# Altium project S7CAS-PLEIADES-CARTE-MERE_P01.PrjPcb (part 4 of 4)

## Sheet S7CAS-PLEIADES-CARTE-MERE_P01_FPGA-ALIM.SchDoc
size Tabloid; DocumentNumber: 17; SheetNumber: 17; SheetTotal: 17; Sheet_Name: FPGA - ALIM; Size: 11x17
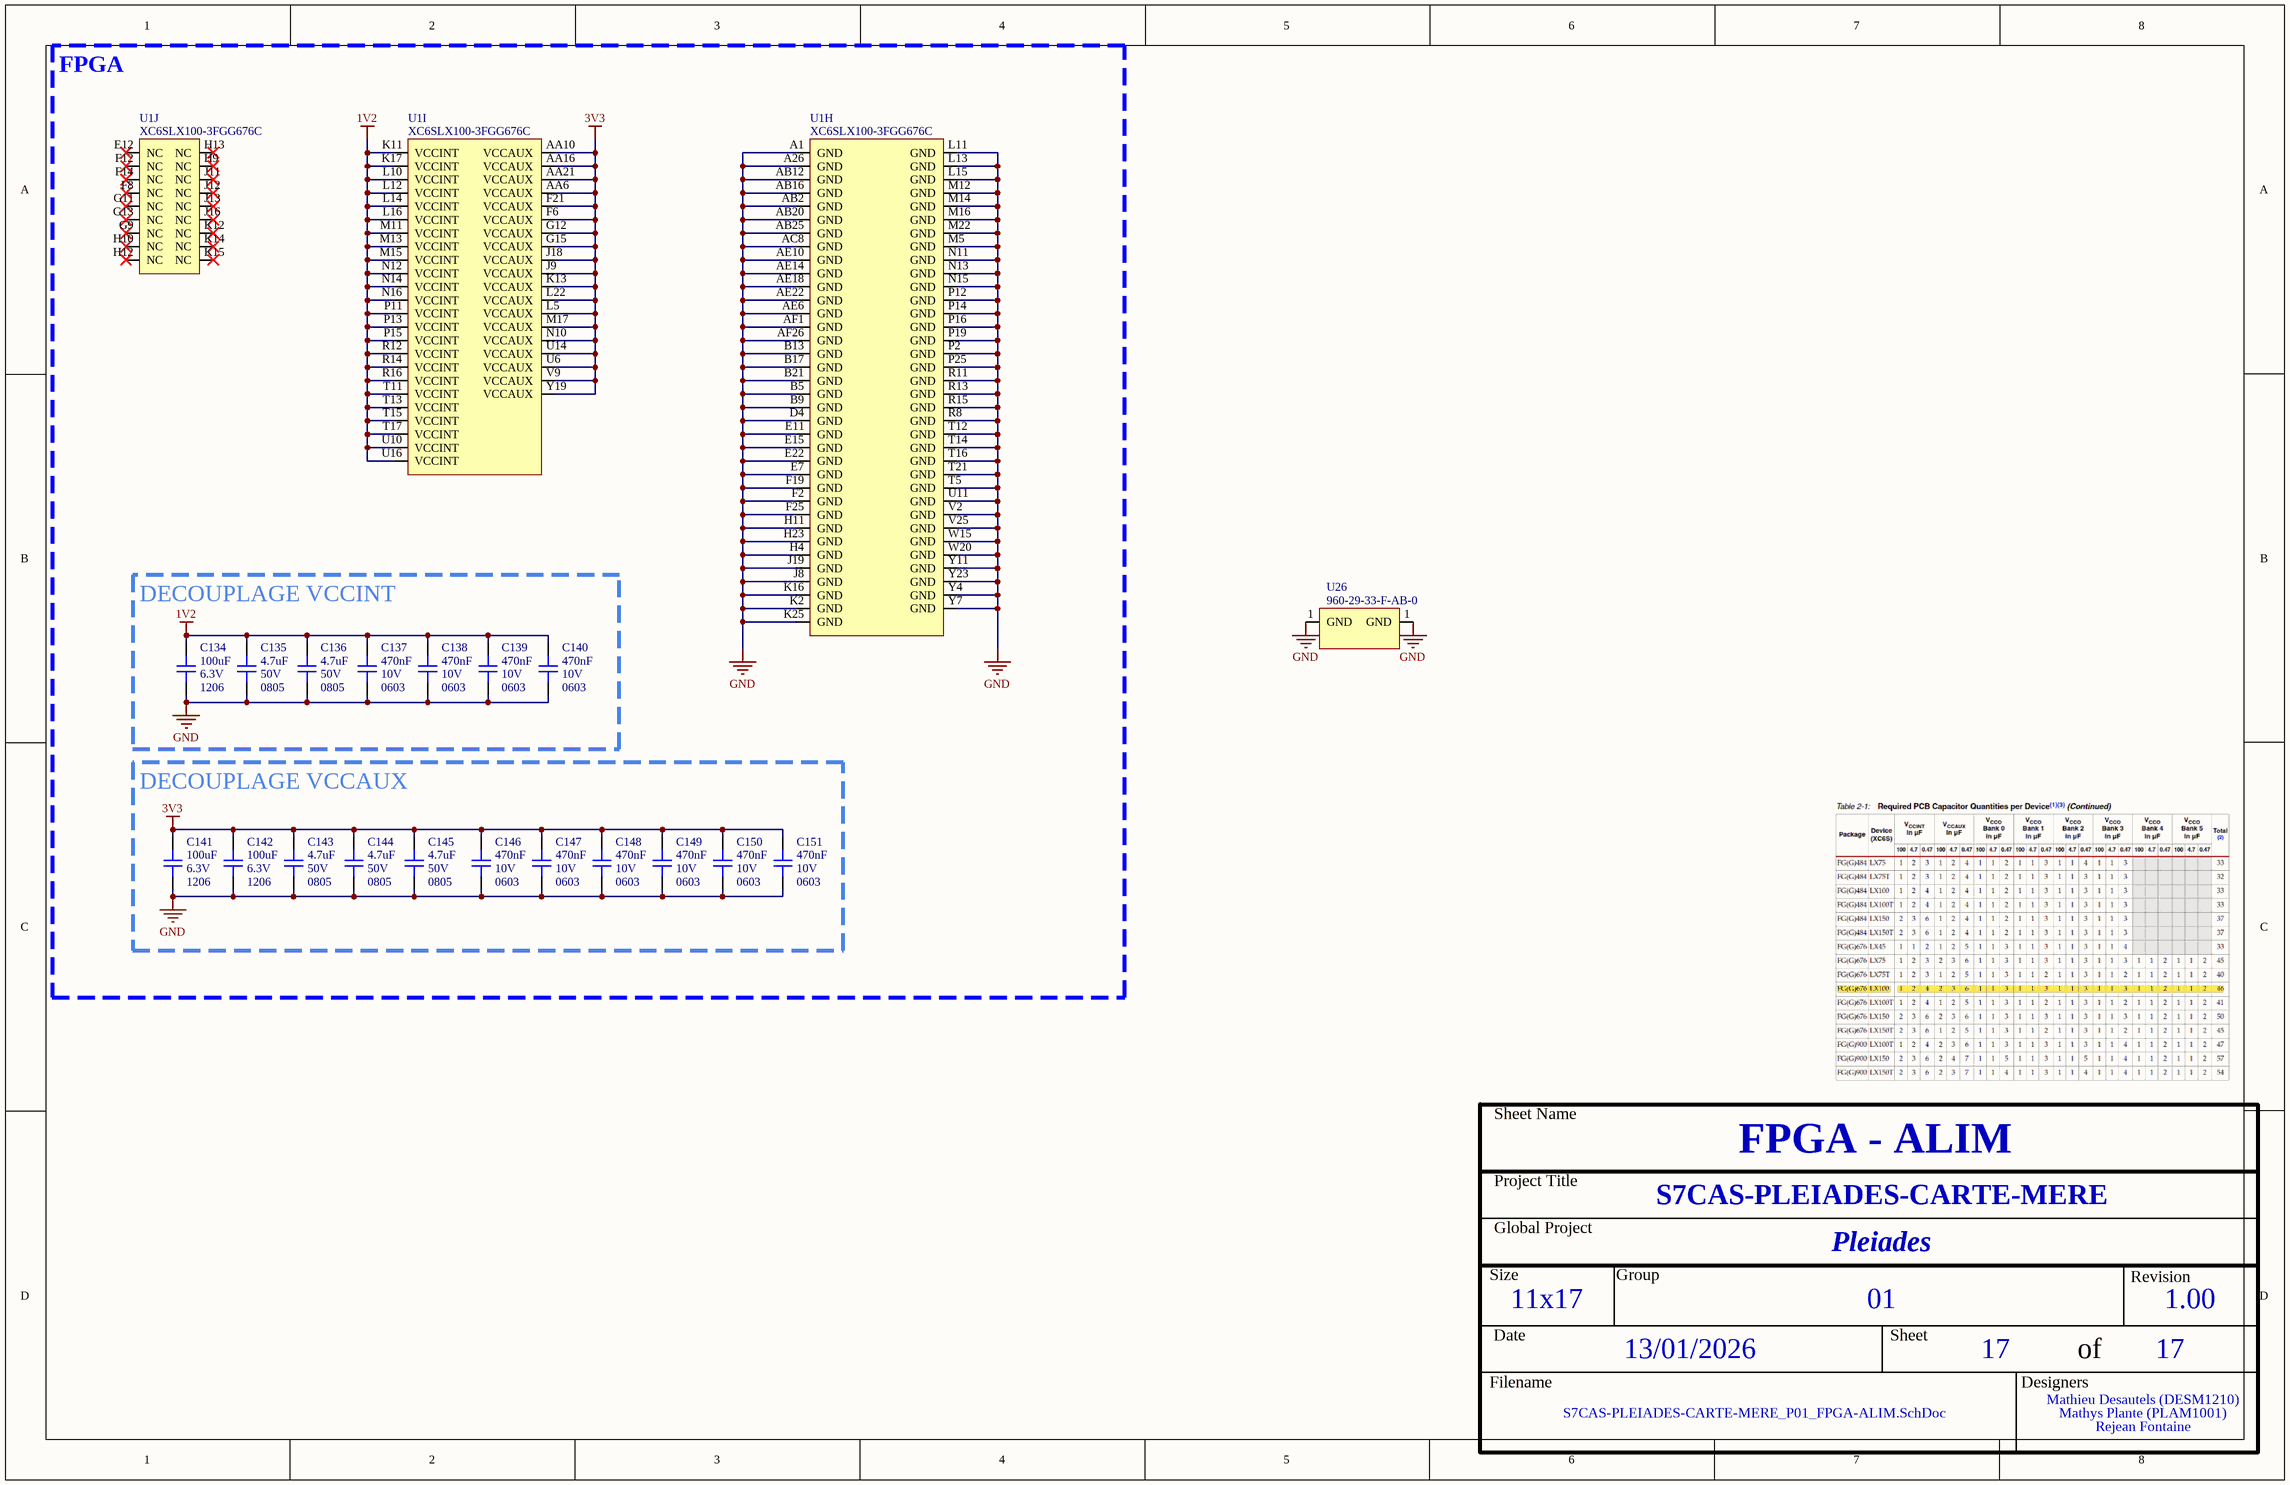
[diagram p16: S7CAS-PLEIADES-CARTE-MERE_P01_FPGA-ALIM.SchDoc]

### Parts
C134  value 100uF  Voltage: 6.3V  Package: 1206  [CAP_1206]  (hidden comment: CAP - 1206)
C135  value 4.7uF  Voltage: 50V  Package: 0805  [CAP_0805]  (hidden comment: CAP - 0805)
C136  value 4.7uF  Voltage: 50V  Package: 0805  [CAP_0805]  (hidden comment: CAP - 0805)
C137  value 470nF  Voltage: 10V  Package: 0603  [CAP_0603]  (hidden comment: CAP - 0603)
C138  value 470nF  Voltage: 10V  Package: 0603  [CAP_0603]  (hidden comment: CAP - 0603)
C139  value 470nF  Voltage: 10V  Package: 0603  [CAP_0603]  (hidden comment: CAP - 0603)
C140  value 470nF  Voltage: 10V  Package: 0603  [CAP_0603]  (hidden comment: CAP - 0603)
C141  value 100uF  Voltage: 6.3V  Package: 1206  [CAP_1206]  (hidden comment: CAP - 1206)
C142  value 100uF  Voltage: 6.3V  Package: 1206  [CAP_1206]  (hidden comment: CAP - 1206)
C143  value 4.7uF  Voltage: 50V  Package: 0805  [CAP_0805]  (hidden comment: CAP - 0805)
C144  value 4.7uF  Voltage: 50V  Package: 0805  [CAP_0805]  (hidden comment: CAP - 0805)
C145  value 4.7uF  Voltage: 50V  Package: 0805  [CAP_0805]  (hidden comment: CAP - 0805)
C146  value 470nF  Voltage: 10V  Package: 0603  [CAP_0603]  (hidden comment: CAP - 0603)
C147  value 470nF  Voltage: 10V  Package: 0603  [CAP_0603]  (hidden comment: CAP - 0603)
C148  value 470nF  Voltage: 10V  Package: 0603  [CAP_0603]  (hidden comment: CAP - 0603)
C149  value 470nF  Voltage: 10V  Package: 0603  [CAP_0603]  (hidden comment: CAP - 0603)
C150  value 470nF  Voltage: 10V  Package: 0603  [CAP_0603]  (hidden comment: CAP - 0603)
C151  value 470nF  Voltage: 10V  Package: 0603  [CAP_0603]  (hidden comment: CAP - 0603)
U1  XC6SLX100-3FGG676C  [FPGA_XILINX_FGG676]  (parts H,I,J of 10)
U26  960-29-33-F-AB-0  [3960-29-33-F-AB-0]

### Blocks framed on the sheet
FPGA: U1
DECOUPLAGE VCCINT: C134-C140
DECOUPLAGE VCCAUX: C141-C151

### Nets
1V2: C134.2 C135.2 C136.2 C137.2 C138.2 C139.2 C140.2 U1.K11(VCCINT) U1.K17(VCCINT) U1.L10(VCCINT) U1.L12(VCCINT) U1.L14(VCCINT) U1.L16(VCCINT) U1.M11(VCCINT) U1.M13(VCCINT) U1.M15(VCCINT) U1.N12(VCCINT) U1.N14(VCCINT) U1.N16(VCCINT) U1.P11(VCCINT) U1.P13(VCCINT) U1.P15(VCCINT) U1.R12(VCCINT) U1.R14(VCCINT) U1.R16(VCCINT) U1.T11(VCCINT) U1.T13(VCCINT) U1.T15(VCCINT) U1.T17(VCCINT) U1.U10(VCCINT) U1.U16(VCCINT)
3V3: C141.2 C142.2 C143.2 C144.2 C145.2 C146.2 C147.2 C148.2 C149.2 C150.2 C151.2 U1.AA6(VCCAUX) U1.AA10(VCCAUX) U1.AA16(VCCAUX) U1.AA21(VCCAUX) U1.F6(VCCAUX) U1.F21(VCCAUX) U1.G12(VCCAUX) U1.G15(VCCAUX) U1.J9(VCCAUX) U1.J18(VCCAUX) U1.K13(VCCAUX) U1.L5(VCCAUX) U1.L22(VCCAUX) U1.M17(VCCAUX) U1.N10(VCCAUX) U1.U6(VCCAUX) U1.U14(VCCAUX) U1.V9(VCCAUX) U1.Y19(VCCAUX)  [project net VDD_3V3]
GND: C134.1 C135.1 C136.1 C137.1 C138.1 C139.1 C140.1 C141.1 C142.1 C143.1 C144.1 C145.1 C146.1 C147.1 C148.1 C149.1 C150.1 C151.1 U1.A1(GND) U1.A26(GND) U1.AB2(GND) U1.AB12(GND) U1.AB16(GND) U1.AB20(GND) U1.AB25(GND) U1.AC8(GND) U1.AE6(GND) U1.AE10(GND) U1.AE14(GND) U1.AE18(GND) U1.AE22(GND) U1.AF1(GND) U1.AF26(GND) U1.B5(GND) U1.B9(GND) U1.B13(GND) U1.B17(GND) U1.B21(GND) U1.D4(GND) U1.E7(GND) U1.E11(GND) U1.E15(GND) U1.E22(GND) U1.F2(GND) U1.F19(GND) U1.F25(GND) U1.H4(GND) U1.H11(GND) U1.H23(GND) U1.J8(GND) U1.J19(GND) U1.K2(GND) U1.K16(GND) U1.K25(GND) U1.L11(GND) U1.L13(GND) U1.L15(GND) U1.M5(GND) U1.M12(GND) U1.M14(GND) U1.M16(GND) U1.M22(GND) U1.N11(GND) U1.N13(GND) U1.N15(GND) U1.P2(GND) U1.P12(GND) U1.P14(GND) U1.P16(GND) U1.P19(GND) U1.P25(GND) U1.R8(GND) U1.R11(GND) U1.R13(GND) U1.R15(GND) U1.T5(GND) U1.T12(GND) U1.T14(GND) U1.T16(GND) U1.T21(GND) U1.U11(GND) U1.V2(GND) U1.V25(GND) U1.W15(GND) U1.W20(GND) U1.Y4(GND) U1.Y7(GND) U1.Y11(GND) U1.Y23(GND) U26.1(GND)

Not connected (* = marked no-connect by the designer): U1 E12(NC)* F8(NC)* F12(NC)* F14(NC)* G9(NC)* G11(NC)* G13(NC)* H9(NC)* H10(NC)* H12(NC)* H13(NC)* J11(NC)* J12(NC)* J13(NC)* J16(NC)* K12(NC)* K14(NC)* K15(NC)*

### Notes on the sheet
- Sheet Name
- Project Title
- Global Project
- Size
- Group
- Revision
- Date
- Sheet
- of
- Filename
- Designers

### Library data of the parts
C134 C141 C142 = CAP - 1206: 100 µF ±20% 6.3V Ceramic Capacitor X6T 1206 (3216 Metric); Mfg Part Number: GRM31CD80J107MEA8K; Mfg: Murata Electronics; Current: *; CreatedBy: Jonathan Bouchard; Power: *; Precision: 20%
C135 C136 C143-C145 = CAP - 0805: 4.7 µF ±10% 50V Ceramic Capacitor X5R 0805 (2012 Metric); Mfg Part Number: GRT21BR61H475KE13L; Mfg: Murata Electronics; Current: *; CreatedBy: Jonathan Bouchard; Power: *; Precision: 10%
C137-C140 C146-C151 = CAP - 0603: Mfg Part Number: C0603X474K8RAC; Precision: 10%; Current: *; CreatedBy: Jonathan Bouchard; Power: *
U1 = FPGA_XC6SLX100-3FGG676C: FPGA - XILINX SPARTAN 6 480 I/O - BGA-676; Voltage: 1.14 V ~ 1.26 V; Current: *; Power: *; Mfg: Xilinx; Mfg Part Number: XC6SLX100-3FGG676C; HelpURL: https://www.xilinx.com/support/documentation/data_sheets/ds162.pdf; CreatedBy: Jonathan Bouchard; Temperature: 0°C ~ 85°C (TJ); Value: *; Precision: *; Package: BGA-676; Supplier 1: Digikey; Supplier Part Number 1: 122-1760-ND; Part Number #1: XC6SLX100-3FGG676C
U26 = 960-29-33-F-AB-0: XXX - Description - Package; GRAMS Lib Spec: 2.7

## Nets that join several sheets
1V2: S7CAS-PLEIADES-CARTE-MERE_P01_ALIM (5 pins), S7CAS-PLEIADES-CARTE-MERE_P01_FPGA-ALIM (31 pins)
5V_AMP: S7CAS-PLEIADES-CARTE-MERE_P01_ALIM (C68.2 R133.2 U25.1 U25.20), S7CAS-PLEIADES-CARTE-MERE_P01_CNA (5 pins), S7CAS-PLEIADES-CARTE-MERE_P01_CAN (12 pins)
+24V: S7CAS-PLEIADES-CARTE-MERE_P01_ALIM (13 pins), S7CAS-PLEIADES-CARTE-MERE_P01_MOTORS (5 pins)
-5V_AMP: S7CAS-PLEIADES-CARTE-MERE_P01_ALIM (C112.2 R125.2 U20.1 U20.20), S7CAS-PLEIADES-CARTE-MERE_P01_CNA (5 pins), S7CAS-PLEIADES-CARTE-MERE_P01_CAN (10 pins)
ANA_3V3: S7CAS-PLEIADES-CARTE-MERE_P01_ALIM (C102.2 R117.2 U19.9 U19.10), S7CAS-PLEIADES-CARTE-MERE_P01_CNA (8 pins), S7CAS-PLEIADES-CARTE-MERE_P01_CAN (7 pins)
CLK_1V8: S7CAS-PLEIADES-CARTE-MERE_P01_ALIM (5 pins), S7CAS-PLEIADES-CARTE-MERE_P01_CNA (12 pins), S7CAS-PLEIADES-CARTE-MERE_P01_CAN (8 pins), S7CAS-PLEIADES-CARTE-MERE_P01_FPGA-BANK4 (10 pins)
GND: S7CAS-PLEIADES-CARTE-MERE_P01_ALIM (92 pins), S7CAS-PLEIADES-CARTE-MERE_P01_CLOCK (20 pins), S7CAS-PLEIADES-CARTE-MERE_P01_ETHERNET (25 pins), S7CAS-PLEIADES-CARTE-MERE_P01_CNA (41 pins), S7CAS-PLEIADES-CARTE-MERE_P01_CAN (46 pins), S7CAS-PLEIADES-CARTE-MERE_P01_DDR3 (79 pins), S7CAS-PLEIADES-CARTE-MERE_P01_MOTORS (20 pins), S7CAS-PLEIADES-CARTE-MERE_P01_IO (15 pins), S7CAS-PLEIADES-CARTE-MERE_P01_FPGA-BANK0 (C25.1 C33.1 C34.1 C35.1), S7CAS-PLEIADES-CARTE-MERE_P01_FPGA-BANK1 (C62.1 C63.1 C64.1 C65.1), S7CAS-PLEIADES-CARTE-MERE_P01_FPGA-BANK2 (23 pins), S7CAS-PLEIADES-CARTE-MERE_P01_FPGA-BANK3 (7 pins), S7CAS-PLEIADES-CARTE-MERE_P01_FPGA-BANK4 (C130.1 C131.1 C132.1 C133.1), S7CAS-PLEIADES-CARTE-MERE_P01_FPGA-ALIM (90 pins)
VCC1V5: S7CAS-PLEIADES-CARTE-MERE_P01_ALIM (5 pins), S7CAS-PLEIADES-CARTE-MERE_P01_DDR3 (40 pins), S7CAS-PLEIADES-CARTE-MERE_P01_FPGA-BANK3 (14 pins)
VDD_3V3: S7CAS-PLEIADES-CARTE-MERE_P01_ALIM (10 pins), S7CAS-PLEIADES-CARTE-MERE_P01_CLOCK (24 pins), S7CAS-PLEIADES-CARTE-MERE_P01_ETHERNET (10 pins), S7CAS-PLEIADES-CARTE-MERE_P01_DDR3 (C117.2 U3.10), S7CAS-PLEIADES-CARTE-MERE_P01_MOTORS (C1.2 R92.2 R95.2 U10.10), S7CAS-PLEIADES-CARTE-MERE_P01_IO (12 pins), S7CAS-PLEIADES-CARTE-MERE_P01_FPGA-BANK0 (16 pins), S7CAS-PLEIADES-CARTE-MERE_P01_FPGA-BANK1 (13 pins), S7CAS-PLEIADES-CARTE-MERE_P01_FPGA-BANK2 (35 pins), S7CAS-PLEIADES-CARTE-MERE_P01_FPGA-BANK5 (6 pins), S7CAS-PLEIADES-CARTE-MERE_P01_FPGA-ALIM (30 pins)
VREF0V75: S7CAS-PLEIADES-CARTE-MERE_P01_DDR3 (C50.2 U2.H1 U2.M8 U3.6), S7CAS-PLEIADES-CARTE-MERE_P01_FPGA-BANK3 (7 pins)
CAN_CLK_N: S7CAS-PLEIADES-CARTE-MERE_P01_CLOCK (U12.20), S7CAS-PLEIADES-CARTE-MERE_P01_CAN (C100.2 R60.1)
CAN_CLK_P: S7CAS-PLEIADES-CARTE-MERE_P01_CLOCK (U12.19), S7CAS-PLEIADES-CARTE-MERE_P01_CAN (C99.2 R59.2)
CAN_CLKOUT_N: S7CAS-PLEIADES-CARTE-MERE_P01_CAN (U8.57), S7CAS-PLEIADES-CARTE-MERE_P01_FPGA-BANK0 (U1.A14)
CAN_CLKOUT_P: S7CAS-PLEIADES-CARTE-MERE_P01_CAN (U8.56), S7CAS-PLEIADES-CARTE-MERE_P01_FPGA-BANK0 (U1.B14)
CAN_CTRL1: S7CAS-PLEIADES-CARTE-MERE_P01_CAN (U8.35), S7CAS-PLEIADES-CARTE-MERE_P01_FPGA-BANK4 (U1.M3)
CAN_CTRL2: S7CAS-PLEIADES-CARTE-MERE_P01_CAN (U8.36), S7CAS-PLEIADES-CARTE-MERE_P01_FPGA-BANK4 (U1.M1)
CAN_CTRL3: S7CAS-PLEIADES-CARTE-MERE_P01_CAN (U8.37), S7CAS-PLEIADES-CARTE-MERE_P01_FPGA-BANK4 (U1.L2)
CAN_DA0_N: S7CAS-PLEIADES-CARTE-MERE_P01_CAN (U8.40), S7CAS-PLEIADES-CARTE-MERE_P01_FPGA-BANK0 (U1.G14)
CAN_DA0_P: S7CAS-PLEIADES-CARTE-MERE_P01_CAN (U8.41), S7CAS-PLEIADES-CARTE-MERE_P01_FPGA-BANK0 (U1.J14)
CAN_DA2_N: S7CAS-PLEIADES-CARTE-MERE_P01_CAN (U8.42), S7CAS-PLEIADES-CARTE-MERE_P01_FPGA-BANK0 (U1.D15)
CAN_DA2_P: S7CAS-PLEIADES-CARTE-MERE_P01_CAN (U8.43), S7CAS-PLEIADES-CARTE-MERE_P01_FPGA-BANK0 (U1.E14)
CAN_DA4_N: S7CAS-PLEIADES-CARTE-MERE_P01_CAN (U8.44), S7CAS-PLEIADES-CARTE-MERE_P01_FPGA-BANK0 (U1.C16)
CAN_DA4_P: S7CAS-PLEIADES-CARTE-MERE_P01_CAN (U8.45), S7CAS-PLEIADES-CARTE-MERE_P01_FPGA-BANK0 (U1.D16)
CAN_DA6_N: S7CAS-PLEIADES-CARTE-MERE_P01_CAN (U8.46), S7CAS-PLEIADES-CARTE-MERE_P01_FPGA-BANK0 (U1.F15)
CAN_DA6_P: S7CAS-PLEIADES-CARTE-MERE_P01_CAN (U8.47), S7CAS-PLEIADES-CARTE-MERE_P01_FPGA-BANK0 (U1.G16)
CAN_DA8_N: S7CAS-PLEIADES-CARTE-MERE_P01_CAN (U8.50), S7CAS-PLEIADES-CARTE-MERE_P01_FPGA-BANK0 (U1.E17)
CAN_DA8_P: S7CAS-PLEIADES-CARTE-MERE_P01_CAN (U8.51), S7CAS-PLEIADES-CARTE-MERE_P01_FPGA-BANK0 (U1.F17)
CAN_DA10_N: S7CAS-PLEIADES-CARTE-MERE_P01_CAN (U8.52), S7CAS-PLEIADES-CARTE-MERE_P01_FPGA-BANK0 (U1.E16)
CAN_DA10_P: S7CAS-PLEIADES-CARTE-MERE_P01_CAN (U8.53), S7CAS-PLEIADES-CARTE-MERE_P01_FPGA-BANK0 (U1.F16)
CAN_DA12_N: S7CAS-PLEIADES-CARTE-MERE_P01_CAN (U8.54), S7CAS-PLEIADES-CARTE-MERE_P01_FPGA-BANK0 (U1.A17)
CAN_DA12_P: S7CAS-PLEIADES-CARTE-MERE_P01_CAN (U8.55), S7CAS-PLEIADES-CARTE-MERE_P01_FPGA-BANK0 (U1.C17)
CAN_DB0_N: S7CAS-PLEIADES-CARTE-MERE_P01_CAN (U8.60), S7CAS-PLEIADES-CARTE-MERE_P01_FPGA-BANK0 (U1.H15)
CAN_DB0_P: S7CAS-PLEIADES-CARTE-MERE_P01_CAN (U8.61), S7CAS-PLEIADES-CARTE-MERE_P01_FPGA-BANK0 (U1.J15)
CAN_DB2_N: S7CAS-PLEIADES-CARTE-MERE_P01_CAN (U8.62), S7CAS-PLEIADES-CARTE-MERE_P01_FPGA-BANK0 (U1.C18)
CAN_DB2_P: S7CAS-PLEIADES-CARTE-MERE_P01_CAN (U8.63), S7CAS-PLEIADES-CARTE-MERE_P01_FPGA-BANK0 (U1.D18)
CAN_DB4_N: S7CAS-PLEIADES-CARTE-MERE_P01_CAN (U8.2), S7CAS-PLEIADES-CARTE-MERE_P01_FPGA-BANK0 (U1.D19)
CAN_DB4_P: S7CAS-PLEIADES-CARTE-MERE_P01_CAN (U8.3), S7CAS-PLEIADES-CARTE-MERE_P01_FPGA-BANK0 (U1.E19)
CAN_DB6_N: S7CAS-PLEIADES-CARTE-MERE_P01_CAN (U8.4), S7CAS-PLEIADES-CARTE-MERE_P01_FPGA-BANK0 (U1.G17)
CAN_DB6_P: S7CAS-PLEIADES-CARTE-MERE_P01_CAN (U8.5), S7CAS-PLEIADES-CARTE-MERE_P01_FPGA-BANK0 (U1.H16)
CAN_DB8_N: S7CAS-PLEIADES-CARTE-MERE_P01_CAN (U8.6), S7CAS-PLEIADES-CARTE-MERE_P01_FPGA-BANK0 (U1.C20)
CAN_DB8_P: S7CAS-PLEIADES-CARTE-MERE_P01_CAN (U8.7), S7CAS-PLEIADES-CARTE-MERE_P01_FPGA-BANK0 (U1.D21)
CAN_DB10_N: S7CAS-PLEIADES-CARTE-MERE_P01_CAN (U8.8), S7CAS-PLEIADES-CARTE-MERE_P01_FPGA-BANK0 (U1.E18)
CAN_DB10_P: S7CAS-PLEIADES-CARTE-MERE_P01_CAN (U8.9), S7CAS-PLEIADES-CARTE-MERE_P01_FPGA-BANK0 (U1.F18)
CAN_DB12_N: S7CAS-PLEIADES-CARTE-MERE_P01_CAN (U8.10), S7CAS-PLEIADES-CARTE-MERE_P01_FPGA-BANK0 (U1.D20)
CAN_DB12_P: S7CAS-PLEIADES-CARTE-MERE_P01_CAN (U8.11), S7CAS-PLEIADES-CARTE-MERE_P01_FPGA-BANK0 (U1.E20)
CAN_RESET: S7CAS-PLEIADES-CARTE-MERE_P01_CAN (U8.12), S7CAS-PLEIADES-CARTE-MERE_P01_FPGA-BANK4 (U1.K8)
CAN_SCLK: S7CAS-PLEIADES-CARTE-MERE_P01_CAN (U8.13), S7CAS-PLEIADES-CARTE-MERE_P01_FPGA-BANK4 (U1.L8)
CAN_SDATA: S7CAS-PLEIADES-CARTE-MERE_P01_CAN (U8.14), S7CAS-PLEIADES-CARTE-MERE_P01_FPGA-BANK4 (U1.N1)
CAN_SDOUT: S7CAS-PLEIADES-CARTE-MERE_P01_CAN (U8.64), S7CAS-PLEIADES-CARTE-MERE_P01_FPGA-BANK4 (U1.L1)
CAN_SEN: S7CAS-PLEIADES-CARTE-MERE_P01_CAN (U8.15), S7CAS-PLEIADES-CARTE-MERE_P01_FPGA-BANK4 (U1.N2)
CLK_OSI_125M_OE: S7CAS-PLEIADES-CARTE-MERE_P01_CLOCK (Y2.2), S7CAS-PLEIADES-CARTE-MERE_P01_FPGA-BANK2 (U1.U15)
CLK_PLL_LOCK: S7CAS-PLEIADES-CARTE-MERE_P01_CLOCK (U12.37), S7CAS-PLEIADES-CARTE-MERE_P01_FPGA-BANK2 (U1.AD11)
CLK_PWRDN: S7CAS-PLEIADES-CARTE-MERE_P01_CLOCK (U12.12), S7CAS-PLEIADES-CARTE-MERE_P01_FPGA-BANK2 (U1.V14)
CLK_SPI_CLK: S7CAS-PLEIADES-CARTE-MERE_P01_CLOCK (U12.24), S7CAS-PLEIADES-CARTE-MERE_P01_FPGA-BANK2 (U1.AB11)
CLK_SPI_LE: S7CAS-PLEIADES-CARTE-MERE_P01_CLOCK (U12.25), S7CAS-PLEIADES-CARTE-MERE_P01_FPGA-BANK2 (U1.AA11)
CLK_SPI_MISO: S7CAS-PLEIADES-CARTE-MERE_P01_CLOCK (R54.2), S7CAS-PLEIADES-CARTE-MERE_P01_FPGA-BANK2 (U1.W14)
CLK_SPI_MOSI: S7CAS-PLEIADES-CARTE-MERE_P01_CLOCK (U12.23), S7CAS-PLEIADES-CARTE-MERE_P01_FPGA-BANK2 (U1.V13)
CLK_SYNC: S7CAS-PLEIADES-CARTE-MERE_P01_CLOCK (U12.14), S7CAS-PLEIADES-CARTE-MERE_P01_FPGA-BANK2 (U1.AC11)
CNA_CLK_N: S7CAS-PLEIADES-CARTE-MERE_P01_CLOCK (U12.17), S7CAS-PLEIADES-CARTE-MERE_P01_CNA (C95.2 R91.1)
CNA_CLK_P: S7CAS-PLEIADES-CARTE-MERE_P01_CLOCK (U12.16), S7CAS-PLEIADES-CARTE-MERE_P01_CNA (C94.2 R72.2)
CNA_CS: S7CAS-PLEIADES-CARTE-MERE_P01_CNA (U7.33), S7CAS-PLEIADES-CARTE-MERE_P01_FPGA-BANK4 (U1.H1)
CNA_D0_N: S7CAS-PLEIADES-CARTE-MERE_P01_CNA (U7.28), S7CAS-PLEIADES-CARTE-MERE_P01_FPGA-BANK0 (U1.D7)
CNA_D0_P: S7CAS-PLEIADES-CARTE-MERE_P01_CNA (U7.27), S7CAS-PLEIADES-CARTE-MERE_P01_FPGA-BANK0 (U1.E8)
CNA_D1_N: S7CAS-PLEIADES-CARTE-MERE_P01_CNA (U7.26), S7CAS-PLEIADES-CARTE-MERE_P01_FPGA-BANK0 (U1.C8)
CNA_D1_P: S7CAS-PLEIADES-CARTE-MERE_P01_CNA (U7.25), S7CAS-PLEIADES-CARTE-MERE_P01_FPGA-BANK0 (U1.D8)
CNA_D2_N: S7CAS-PLEIADES-CARTE-MERE_P01_CNA (U7.24), S7CAS-PLEIADES-CARTE-MERE_P01_FPGA-BANK0 (U1.E9)
CNA_D2_P: S7CAS-PLEIADES-CARTE-MERE_P01_CNA (U7.23), S7CAS-PLEIADES-CARTE-MERE_P01_FPGA-BANK0 (U1.F9)
CNA_D3_N: S7CAS-PLEIADES-CARTE-MERE_P01_CNA (U7.22), S7CAS-PLEIADES-CARTE-MERE_P01_FPGA-BANK0 (U1.A8)
CNA_D3_P: S7CAS-PLEIADES-CARTE-MERE_P01_CNA (U7.21), S7CAS-PLEIADES-CARTE-MERE_P01_FPGA-BANK0 (U1.B8)
CNA_D4_N: S7CAS-PLEIADES-CARTE-MERE_P01_CNA (U7.16), S7CAS-PLEIADES-CARTE-MERE_P01_FPGA-BANK0 (U1.A9)
CNA_D4_P: S7CAS-PLEIADES-CARTE-MERE_P01_CNA (U7.15), S7CAS-PLEIADES-CARTE-MERE_P01_FPGA-BANK0 (U1.C9)
CNA_D5_N: S7CAS-PLEIADES-CARTE-MERE_P01_CNA (U7.14), S7CAS-PLEIADES-CARTE-MERE_P01_FPGA-BANK0 (U1.F10)
CNA_D5_P: S7CAS-PLEIADES-CARTE-MERE_P01_CNA (U7.13), S7CAS-PLEIADES-CARTE-MERE_P01_FPGA-BANK0 (U1.E10)
CNA_D6_N: S7CAS-PLEIADES-CARTE-MERE_P01_CNA (U7.12), S7CAS-PLEIADES-CARTE-MERE_P01_FPGA-BANK0 (U1.C10)
CNA_D6_P: S7CAS-PLEIADES-CARTE-MERE_P01_CNA (U7.11), S7CAS-PLEIADES-CARTE-MERE_P01_FPGA-BANK0 (U1.D10)
CNA_D7_N: S7CAS-PLEIADES-CARTE-MERE_P01_CNA (U7.10), S7CAS-PLEIADES-CARTE-MERE_P01_FPGA-BANK0 (U1.A10)
CNA_D7_P: S7CAS-PLEIADES-CARTE-MERE_P01_CNA (U7.9), S7CAS-PLEIADES-CARTE-MERE_P01_FPGA-BANK0 (U1.B10)
CNA_DCI_N: S7CAS-PLEIADES-CARTE-MERE_P01_CNA (U7.18), S7CAS-PLEIADES-CARTE-MERE_P01_FPGA-BANK0 (U1.F11)
CNA_DCI_P: S7CAS-PLEIADES-CARTE-MERE_P01_CNA (U7.17), S7CAS-PLEIADES-CARTE-MERE_P01_FPGA-BANK0 (U1.D11)
CNA_FRAME_N: S7CAS-PLEIADES-CARTE-MERE_P01_CNA (U7.20), S7CAS-PLEIADES-CARTE-MERE_P01_FPGA-BANK0 (U1.A11)
CNA_FRAME_P: S7CAS-PLEIADES-CARTE-MERE_P01_CNA (U7.19), S7CAS-PLEIADES-CARTE-MERE_P01_FPGA-BANK0 (U1.C11)
CNA_IRQ: S7CAS-PLEIADES-CARTE-MERE_P01_CNA (U7.34), S7CAS-PLEIADES-CARTE-MERE_P01_FPGA-BANK4 (U1.G2)
CNA_RESET: S7CAS-PLEIADES-CARTE-MERE_P01_CNA (U7.36), S7CAS-PLEIADES-CARTE-MERE_P01_FPGA-BANK4 (U1.J2)
CNA_SCLK: S7CAS-PLEIADES-CARTE-MERE_P01_CNA (U7.32), S7CAS-PLEIADES-CARTE-MERE_P01_FPGA-BANK4 (U1.J1)
CNA_SDIO: S7CAS-PLEIADES-CARTE-MERE_P01_CNA (U7.31), S7CAS-PLEIADES-CARTE-MERE_P01_FPGA-BANK4 (U1.H3)
CNA_TX_ENABLE: S7CAS-PLEIADES-CARTE-MERE_P01_CNA (U7.30), S7CAS-PLEIADES-CARTE-MERE_P01_FPGA-BANK4 (U1.G1)
DDR3_A0: S7CAS-PLEIADES-CARTE-MERE_P01_DDR3 (R1.1 U2.N3), S7CAS-PLEIADES-CARTE-MERE_P01_FPGA-BANK3 (U1.N7)
DDR3_A1: S7CAS-PLEIADES-CARTE-MERE_P01_DDR3 (R2.1 U2.P7), S7CAS-PLEIADES-CARTE-MERE_P01_FPGA-BANK3 (U1.N6)
DDR3_A2: S7CAS-PLEIADES-CARTE-MERE_P01_DDR3 (R3.1 U2.P3), S7CAS-PLEIADES-CARTE-MERE_P01_FPGA-BANK3 (U1.R9)
DDR3_A3: S7CAS-PLEIADES-CARTE-MERE_P01_DDR3 (R4.1 U2.N2), S7CAS-PLEIADES-CARTE-MERE_P01_FPGA-BANK3 (U1.P7)
DDR3_A4: S7CAS-PLEIADES-CARTE-MERE_P01_DDR3 (R5.1 U2.P8), S7CAS-PLEIADES-CARTE-MERE_P01_FPGA-BANK3 (U1.N9)
DDR3_A5: S7CAS-PLEIADES-CARTE-MERE_P01_DDR3 (R6.1 U2.P2), S7CAS-PLEIADES-CARTE-MERE_P01_FPGA-BANK3 (U1.R2)
DDR3_A6: S7CAS-PLEIADES-CARTE-MERE_P01_DDR3 (R7.1 U2.R8), S7CAS-PLEIADES-CARTE-MERE_P01_FPGA-BANK3 (U1.R1)
DDR3_A7: S7CAS-PLEIADES-CARTE-MERE_P01_DDR3 (R8.1 U2.R2), S7CAS-PLEIADES-CARTE-MERE_P01_FPGA-BANK3 (U1.P10)
DDR3_A8: S7CAS-PLEIADES-CARTE-MERE_P01_DDR3 (R9.1 U2.T8), S7CAS-PLEIADES-CARTE-MERE_P01_FPGA-BANK3 (U1.N4)
DDR3_A9: S7CAS-PLEIADES-CARTE-MERE_P01_DDR3 (R10.1 U2.R3), S7CAS-PLEIADES-CARTE-MERE_P01_FPGA-BANK3 (U1.N3)
DDR3_A10: S7CAS-PLEIADES-CARTE-MERE_P01_DDR3 (R11.1 U2.L7), S7CAS-PLEIADES-CARTE-MERE_P01_FPGA-BANK3 (U1.M10)
DDR3_A11: S7CAS-PLEIADES-CARTE-MERE_P01_DDR3 (R12.1 U2.R7), S7CAS-PLEIADES-CARTE-MERE_P01_FPGA-BANK3 (U1.L3)
DDR3_A12: S7CAS-PLEIADES-CARTE-MERE_P01_DDR3 (R13.1 U2.N7), S7CAS-PLEIADES-CARTE-MERE_P01_FPGA-BANK3 (U1.M8)
DDR3_A13: S7CAS-PLEIADES-CARTE-MERE_P01_DDR3 (R14.1 U2.T3), S7CAS-PLEIADES-CARTE-MERE_P01_FPGA-BANK3 (U1.M6)
DDR3_BA0: S7CAS-PLEIADES-CARTE-MERE_P01_DDR3 (R15.1 U2.M2), S7CAS-PLEIADES-CARTE-MERE_P01_FPGA-BANK3 (U1.P3)
DDR3_BA1: S7CAS-PLEIADES-CARTE-MERE_P01_DDR3 (R16.1 U2.N8), S7CAS-PLEIADES-CARTE-MERE_P01_FPGA-BANK3 (U1.P1)
DDR3_BA2: S7CAS-PLEIADES-CARTE-MERE_P01_DDR3 (R17.1 U2.M3), S7CAS-PLEIADES-CARTE-MERE_P01_FPGA-BANK3 (U1.N5)
DDR3_CAS: S7CAS-PLEIADES-CARTE-MERE_P01_DDR3 (R22.1 U2.K3), S7CAS-PLEIADES-CARTE-MERE_P01_FPGA-BANK3 (U1.P8)
DDR3_CK_N: S7CAS-PLEIADES-CARTE-MERE_P01_DDR3 (R27.1 U2.K7), S7CAS-PLEIADES-CARTE-MERE_P01_FPGA-BANK3 (U1.R3)
DDR3_CK_P: S7CAS-PLEIADES-CARTE-MERE_P01_DDR3 (R26.2 U2.J7), S7CAS-PLEIADES-CARTE-MERE_P01_FPGA-BANK3 (U1.R4)
DDR3_CKE: S7CAS-PLEIADES-CARTE-MERE_P01_DDR3 (R19.1 U2.K9), S7CAS-PLEIADES-CARTE-MERE_P01_FPGA-BANK3 (U1.M9)
DDR3_DQ0: S7CAS-PLEIADES-CARTE-MERE_P01_DDR3 (U2.E3), S7CAS-PLEIADES-CARTE-MERE_P01_FPGA-BANK3 (U1.Y3)
DDR3_DQ1: S7CAS-PLEIADES-CARTE-MERE_P01_DDR3 (U2.F7), S7CAS-PLEIADES-CARTE-MERE_P01_FPGA-BANK3 (U1.Y1)
DDR3_DQ2: S7CAS-PLEIADES-CARTE-MERE_P01_DDR3 (U2.F2), S7CAS-PLEIADES-CARTE-MERE_P01_FPGA-BANK3 (U1.W2)
DDR3_DQ3: S7CAS-PLEIADES-CARTE-MERE_P01_DDR3 (U2.F8), S7CAS-PLEIADES-CARTE-MERE_P01_FPGA-BANK3 (U1.W1)
DDR3_DQ4: S7CAS-PLEIADES-CARTE-MERE_P01_DDR3 (U2.H3), S7CAS-PLEIADES-CARTE-MERE_P01_FPGA-BANK3 (U1.T3)
DDR3_DQ5: S7CAS-PLEIADES-CARTE-MERE_P01_DDR3 (U2.H8), S7CAS-PLEIADES-CARTE-MERE_P01_FPGA-BANK3 (U1.T1)
DDR3_DQ6: S7CAS-PLEIADES-CARTE-MERE_P01_DDR3 (U2.G2), S7CAS-PLEIADES-CARTE-MERE_P01_FPGA-BANK3 (U1.U2)
DDR3_DQ7: S7CAS-PLEIADES-CARTE-MERE_P01_DDR3 (U2.H7), S7CAS-PLEIADES-CARTE-MERE_P01_FPGA-BANK3 (U1.U1)
DDR3_DQ8: S7CAS-PLEIADES-CARTE-MERE_P01_DDR3 (U2.D7), S7CAS-PLEIADES-CARTE-MERE_P01_FPGA-BANK3 (U1.AA2)
DDR3_DQ9: S7CAS-PLEIADES-CARTE-MERE_P01_DDR3 (U2.C3), S7CAS-PLEIADES-CARTE-MERE_P01_FPGA-BANK3 (U1.AA1)
DDR3_DQ10: S7CAS-PLEIADES-CARTE-MERE_P01_DDR3 (U2.C8), S7CAS-PLEIADES-CARTE-MERE_P01_FPGA-BANK3 (U1.AE2)
DDR3_DQ11: S7CAS-PLEIADES-CARTE-MERE_P01_DDR3 (U2.C2), S7CAS-PLEIADES-CARTE-MERE_P01_FPGA-BANK3 (U1.AE1)
DDR3_DQ12: S7CAS-PLEIADES-CARTE-MERE_P01_DDR3 (U2.A7), S7CAS-PLEIADES-CARTE-MERE_P01_FPGA-BANK3 (U1.AD3)
DDR3_DQ13: S7CAS-PLEIADES-CARTE-MERE_P01_DDR3 (U2.A2), S7CAS-PLEIADES-CARTE-MERE_P01_FPGA-BANK3 (U1.AD1)
DDR3_DQ14: S7CAS-PLEIADES-CARTE-MERE_P01_DDR3 (U2.B8), S7CAS-PLEIADES-CARTE-MERE_P01_FPGA-BANK3 (U1.AB3)
DDR3_DQ15: S7CAS-PLEIADES-CARTE-MERE_P01_DDR3 (U2.A3), S7CAS-PLEIADES-CARTE-MERE_P01_FPGA-BANK3 (U1.AB1)
DDR3_LDM: S7CAS-PLEIADES-CARTE-MERE_P01_DDR3 (U2.E7), S7CAS-PLEIADES-CARTE-MERE_P01_FPGA-BANK3 (U1.W3)
DDR3_LDQS_N: S7CAS-PLEIADES-CARTE-MERE_P01_DDR3 (U2.G3), S7CAS-PLEIADES-CARTE-MERE_P01_FPGA-BANK3 (U1.V1)
DDR3_LDQS_P: S7CAS-PLEIADES-CARTE-MERE_P01_DDR3 (U2.F3), S7CAS-PLEIADES-CARTE-MERE_P01_FPGA-BANK3 (U1.V3)
DDR3_ODT: S7CAS-PLEIADES-CARTE-MERE_P01_DDR3 (R24.1 U2.K1), S7CAS-PLEIADES-CARTE-MERE_P01_FPGA-BANK3 (U1.P6)
DDR3_RAS: S7CAS-PLEIADES-CARTE-MERE_P01_DDR3 (R21.1 U2.J3), S7CAS-PLEIADES-CARTE-MERE_P01_FPGA-BANK3 (U1.N8)
DDR3_RESET: S7CAS-PLEIADES-CARTE-MERE_P01_DDR3 (R25.2 U2.T2), S7CAS-PLEIADES-CARTE-MERE_P01_FPGA-BANK3 (U1.L4)
DDR3_UDM: S7CAS-PLEIADES-CARTE-MERE_P01_DDR3 (U2.D3), S7CAS-PLEIADES-CARTE-MERE_P01_FPGA-BANK3 (U1.V4)
DDR3_UDQS_N: S7CAS-PLEIADES-CARTE-MERE_P01_DDR3 (U2.B7), S7CAS-PLEIADES-CARTE-MERE_P01_FPGA-BANK3 (U1.AC1)
DDR3_UDQS_P: S7CAS-PLEIADES-CARTE-MERE_P01_DDR3 (U2.C7), S7CAS-PLEIADES-CARTE-MERE_P01_FPGA-BANK3 (U1.AC2)
DDR3_WE: S7CAS-PLEIADES-CARTE-MERE_P01_DDR3 (R23.1 U2.L3), S7CAS-PLEIADES-CARTE-MERE_P01_FPGA-BANK3 (U1.P5)
ETH_COL: S7CAS-PLEIADES-CARTE-MERE_P01_ETHERNET (U5.28), S7CAS-PLEIADES-CARTE-MERE_P01_FPGA-BANK2 (U1.AD21)
ETH_CRS: S7CAS-PLEIADES-CARTE-MERE_P01_ETHERNET (U5.29), S7CAS-PLEIADES-CARTE-MERE_P01_FPGA-BANK2 (U1.Y18)
ETH_INTR: S7CAS-PLEIADES-CARTE-MERE_P01_ETHERNET (U5.21), S7CAS-PLEIADES-CARTE-MERE_P01_FPGA-BANK2 (U1.AA19)
ETH_MDC: S7CAS-PLEIADES-CARTE-MERE_P01_ETHERNET (U5.12), S7CAS-PLEIADES-CARTE-MERE_P01_FPGA-BANK2 (U1.AC20)
ETH_MDIO: S7CAS-PLEIADES-CARTE-MERE_P01_ETHERNET (R18.1 U5.11), S7CAS-PLEIADES-CARTE-MERE_P01_FPGA-BANK2 (U1.AF19)
ETH_RST: S7CAS-PLEIADES-CARTE-MERE_P01_ETHERNET (R57.2 U5.32), S7CAS-PLEIADES-CARTE-MERE_P01_FPGA-BANK2 (U1.AE19)
ETH_RXC: S7CAS-PLEIADES-CARTE-MERE_P01_ETHERNET (U5.19), S7CAS-PLEIADES-CARTE-MERE_P01_FPGA-BANK2 (U1.AE13)
ETH_RXD0: S7CAS-PLEIADES-CARTE-MERE_P01_ETHERNET (U5.16), S7CAS-PLEIADES-CARTE-MERE_P01_FPGA-BANK2 (U1.V16)
ETH_RXD1: S7CAS-PLEIADES-CARTE-MERE_P01_ETHERNET (U5.15), S7CAS-PLEIADES-CARTE-MERE_P01_FPGA-BANK2 (U1.W17)
ETH_RXD2: S7CAS-PLEIADES-CARTE-MERE_P01_ETHERNET (U5.14), S7CAS-PLEIADES-CARTE-MERE_P01_FPGA-BANK2 (U1.AD18)
ETH_RXD3: S7CAS-PLEIADES-CARTE-MERE_P01_ETHERNET (U5.13), S7CAS-PLEIADES-CARTE-MERE_P01_FPGA-BANK2 (U1.AF18)
ETH_RXDV: S7CAS-PLEIADES-CARTE-MERE_P01_ETHERNET (U5.18), S7CAS-PLEIADES-CARTE-MERE_P01_FPGA-BANK2 (U1.AC19)
ETH_RXER: S7CAS-PLEIADES-CARTE-MERE_P01_ETHERNET (U5.20), S7CAS-PLEIADES-CARTE-MERE_P01_FPGA-BANK2 (U1.AD19)
ETH_TXC: S7CAS-PLEIADES-CARTE-MERE_P01_ETHERNET (U5.22), S7CAS-PLEIADES-CARTE-MERE_P01_FPGA-BANK2 (U1.AF13)
ETH_TXD0: S7CAS-PLEIADES-CARTE-MERE_P01_ETHERNET (U5.24), S7CAS-PLEIADES-CARTE-MERE_P01_FPGA-BANK2 (U1.AA18)
ETH_TXD1: S7CAS-PLEIADES-CARTE-MERE_P01_ETHERNET (U5.25), S7CAS-PLEIADES-CARTE-MERE_P01_FPGA-BANK2 (U1.AB18)
ETH_TXD2: S7CAS-PLEIADES-CARTE-MERE_P01_ETHERNET (U5.26), S7CAS-PLEIADES-CARTE-MERE_P01_FPGA-BANK2 (U1.AE17)
ETH_TXD3: S7CAS-PLEIADES-CARTE-MERE_P01_ETHERNET (U5.27), S7CAS-PLEIADES-CARTE-MERE_P01_FPGA-BANK2 (U1.AF17)
ETH_TXEN: S7CAS-PLEIADES-CARTE-MERE_P01_ETHERNET (U5.23), S7CAS-PLEIADES-CARTE-MERE_P01_FPGA-BANK2 (U1.Y16)
ETH_TXER: S7CAS-PLEIADES-CARTE-MERE_P01_ETHERNET (U5.31), S7CAS-PLEIADES-CARTE-MERE_P01_FPGA-BANK2 (U1.AA17)
FPGA_CLK_N: S7CAS-PLEIADES-CARTE-MERE_P01_CLOCK (U12.28), S7CAS-PLEIADES-CARTE-MERE_P01_FPGA-BANK2 (U1.AF14)
FPGA_CLK_P: S7CAS-PLEIADES-CARTE-MERE_P01_CLOCK (U12.27), S7CAS-PLEIADES-CARTE-MERE_P01_FPGA-BANK2 (U1.AD14)
IO_BUTTON1: S7CAS-PLEIADES-CARTE-MERE_P01_IO (D8.K R105.2 S2.1 S2.2), S7CAS-PLEIADES-CARTE-MERE_P01_FPGA-BANK2 (U1.W11)
IO_BUTTON2: S7CAS-PLEIADES-CARTE-MERE_P01_IO (D9.K R106.2 S3.1 S3.2), S7CAS-PLEIADES-CARTE-MERE_P01_FPGA-BANK2 (U1.AD8)
IO_LED1: S7CAS-PLEIADES-CARTE-MERE_P01_IO (R100.2), S7CAS-PLEIADES-CARTE-MERE_P01_FPGA-BANK2 (U1.U13)
IO_LED2: S7CAS-PLEIADES-CARTE-MERE_P01_IO (R101.2), S7CAS-PLEIADES-CARTE-MERE_P01_FPGA-BANK2 (U1.U12)
IO_LED3: S7CAS-PLEIADES-CARTE-MERE_P01_IO (R102.2), S7CAS-PLEIADES-CARTE-MERE_P01_FPGA-BANK2 (U1.Y10)
IO_LED4: S7CAS-PLEIADES-CARTE-MERE_P01_IO (R103.2), S7CAS-PLEIADES-CARTE-MERE_P01_FPGA-BANK2 (U1.AB10)
IO_SCLK_TEMP1: S7CAS-PLEIADES-CARTE-MERE_P01_IO (R129.1 U23.4), S7CAS-PLEIADES-CARTE-MERE_P01_FPGA-BANK2 (U1.AF8)
IO_SCLK_TEMP2: S7CAS-PLEIADES-CARTE-MERE_P01_IO (R131.1 U24.4), S7CAS-PLEIADES-CARTE-MERE_P01_FPGA-BANK2 (U1.AD9)
IO_TEMP1: S7CAS-PLEIADES-CARTE-MERE_P01_IO (R130.1 U23.5), S7CAS-PLEIADES-CARTE-MERE_P01_FPGA-BANK2 (U1.AC9)
IO_TEMP2: S7CAS-PLEIADES-CARTE-MERE_P01_IO (R132.1 U24.5), S7CAS-PLEIADES-CARTE-MERE_P01_FPGA-BANK2 (U1.AA9)
MOT_DIR: S7CAS-PLEIADES-CARTE-MERE_P01_MOTORS (U10.3), S7CAS-PLEIADES-CARTE-MERE_P01_FPGA-BANK1 (U1.R20)
MOT_ENABLE: S7CAS-PLEIADES-CARTE-MERE_P01_MOTORS (U10.26), S7CAS-PLEIADES-CARTE-MERE_P01_FPGA-BANK1 (U1.R18)
MOT_HOME: S7CAS-PLEIADES-CARTE-MERE_P01_MOTORS (U10.2), S7CAS-PLEIADES-CARTE-MERE_P01_FPGA-BANK1 (U1.R22)
MOT_RESET: S7CAS-PLEIADES-CARTE-MERE_P01_MOTORS (U10.17), S7CAS-PLEIADES-CARTE-MERE_P01_FPGA-BANK1 (U1.T22)
MOT_SLEEP: S7CAS-PLEIADES-CARTE-MERE_P01_MOTORS (U10.27), S7CAS-PLEIADES-CARTE-MERE_P01_FPGA-BANK1 (U1.R17)
MOT_SR: S7CAS-PLEIADES-CARTE-MERE_P01_MOTORS (U10.16), S7CAS-PLEIADES-CARTE-MERE_P01_FPGA-BANK1 (U1.R21)
MOT_STEP: S7CAS-PLEIADES-CARTE-MERE_P01_MOTORS (U10.19), S7CAS-PLEIADES-CARTE-MERE_P01_FPGA-BANK1 (U1.R19)
MOT_USM0: S7CAS-PLEIADES-CARTE-MERE_P01_MOTORS (U10.13), S7CAS-PLEIADES-CARTE-MERE_P01_FPGA-BANK1 (U1.P18)
MOT_USM1: S7CAS-PLEIADES-CARTE-MERE_P01_MOTORS (U10.12), S7CAS-PLEIADES-CARTE-MERE_P01_FPGA-BANK1 (U1.P17)
PG_1V5: S7CAS-PLEIADES-CARTE-MERE_P01_ALIM (R53.1 U14.3), S7CAS-PLEIADES-CARTE-MERE_P01_DDR3 (U3.7)
PG_DDR3: S7CAS-PLEIADES-CARTE-MERE_P01_DDR3 (U3.9), S7CAS-PLEIADES-CARTE-MERE_P01_IO (R30.1 U13.5)
PROGRAM_B: S7CAS-PLEIADES-CARTE-MERE_P01_IO (U13.1), S7CAS-PLEIADES-CARTE-MERE_P01_FPGA-BANK2 (M1.9 R37.1 R58.1 U1.AF3)

## Assembly variants
S7CAS-PLEIADES-CARTE-MERE_P01: not fitted R46